# EAGLE design zergpower (EAGLE 4.01)
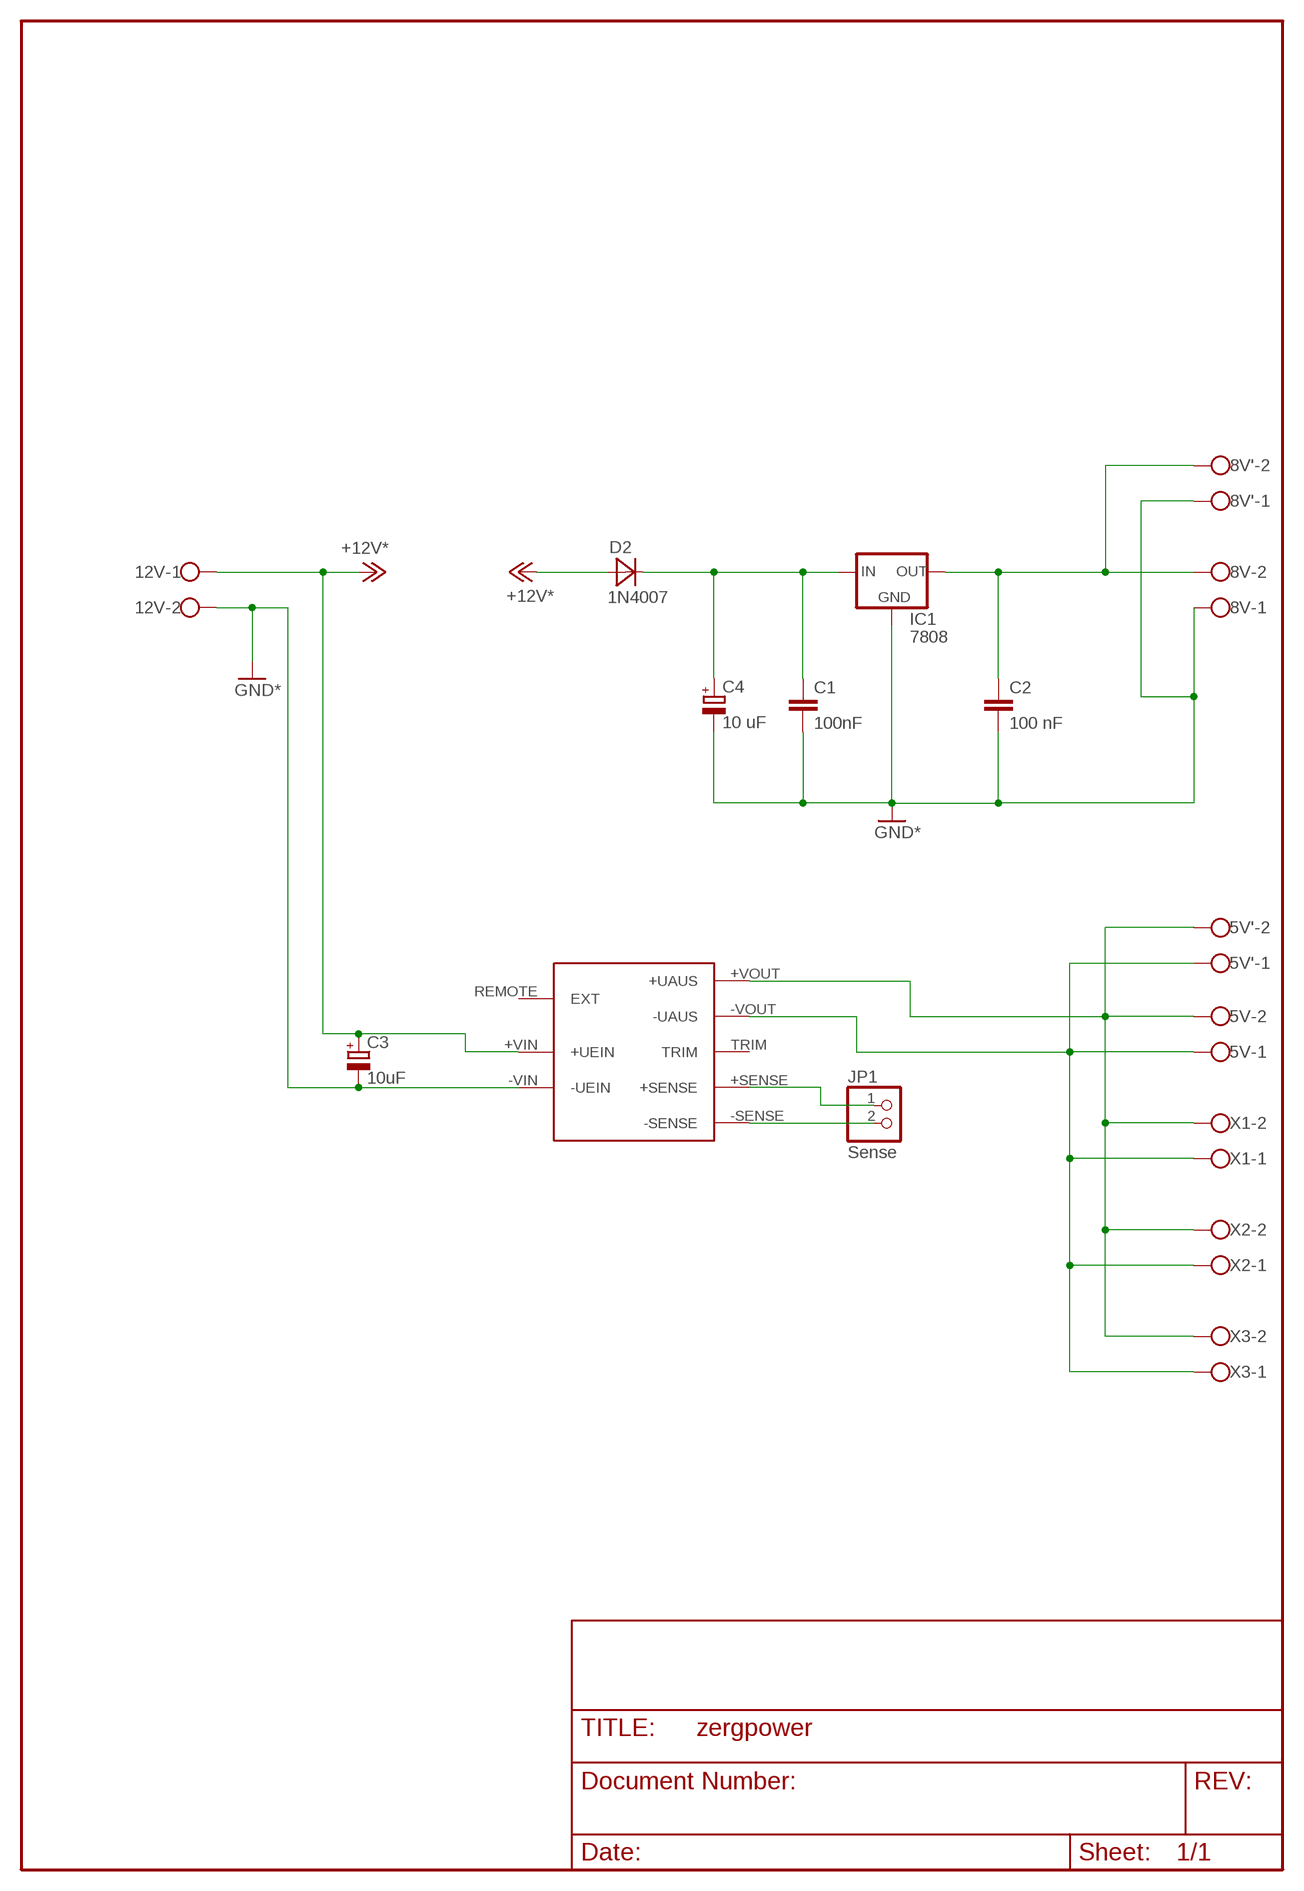
[diagram p0: schematic, sheet 1]

## Parts
5V  AK500/2  [AK500/2]
5V'  AK500/2  [AK500/2]
8V  AK500/2  [AK500/2]
8V'  AK500/2  [AK500/2]
12V  AK500/2  [AK500/2]
C1  100nF  C-EU025-025X050  [C025-025X050]
C2  100 nF  C-EU025-025X050  [C025-025X050]
C3  10uF  CPOL-EUE2.5-7  [E2,5-7]
C4  10 uF  CPOL-EUE2.5-5  [E2,5-5]
D2  1N4007  DIODE-12.5  [D-12.5]
IC1  7808  78XXS  [78XXS]
JP1  Sense  PINHD-1X2  [1X02]
U$1  TEN40N  [TEN40P]
X1  AK500/2  [AK500/2]
X2  AK500/2  [AK500/2]
X3  AK500/2  [AK500/2]

## Nets
+12V: 12V.1 C3.+ D2.A U$1.+VIN(+UEIN) ; supply symbol labelled +12V*
+UAUS: 5V'.2 5V.2 U$1.+VOUT(+UAUS) X1.2 X2.2 X3.2
-UAUS: 5V'.1 5V.1 U$1.-VOUT(-UAUS) X1.1 X2.1 X3.1
GND: 8V'.1 8V.1 12V.2 C1.1 C2.1 C3.- C4.- IC1.GND U$1.-VIN(-UEIN) ; supply symbol labelled GND*
N$1: 8V'.2 8V.2 C2.2 IC1.OUT
N$3: C1.2 C4.+ D2.K(C) IC1.IN
N$9: JP1.1 U$1.+SENSE
N$10: JP1.2 U$1.-SENSE
Unconnected: U$1.REMOTE(EXT) U$1.TRIM

## Library data of the parts
5V 5V' 8V 8V' 12V X1-X3 = con-ptr500:AK500/2: CONNECTOR
C1 C2 = rcl:C-EU: CAPACITOR, European symbol
C3 C4 = rcl:CPOL-EU: POLARIZED CAPACITOR, European symbol
D2 = diode:DIODE-: DIODE
IC1 = v-reg:78XXS: VOLTAGE REGULATOR
JP1 = pinhead:PINHD-1X2: PIN HEADER
U$1 = ten:TEN40

## Board
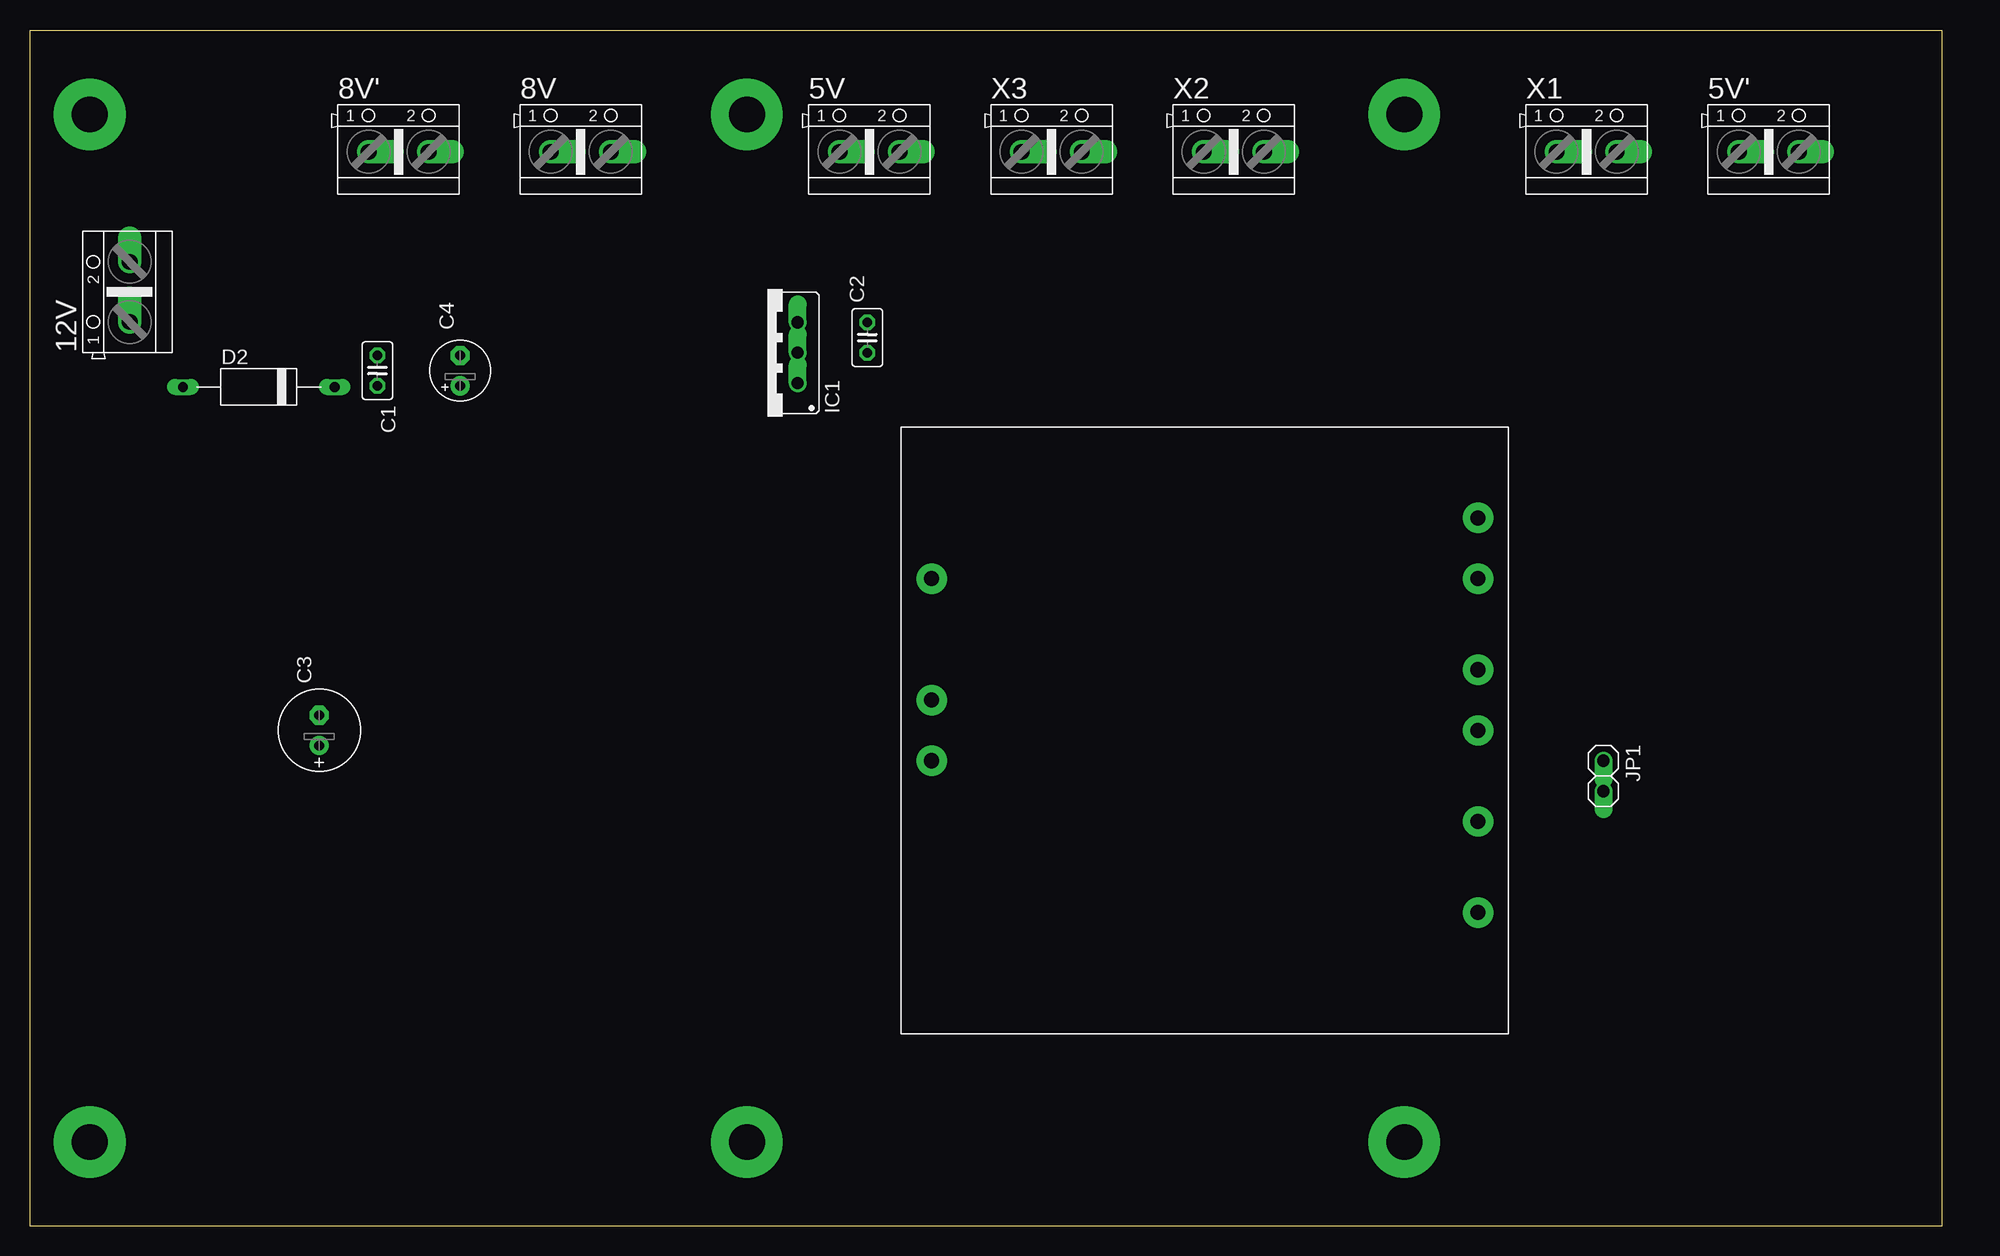
[diagram p1: board, top side]
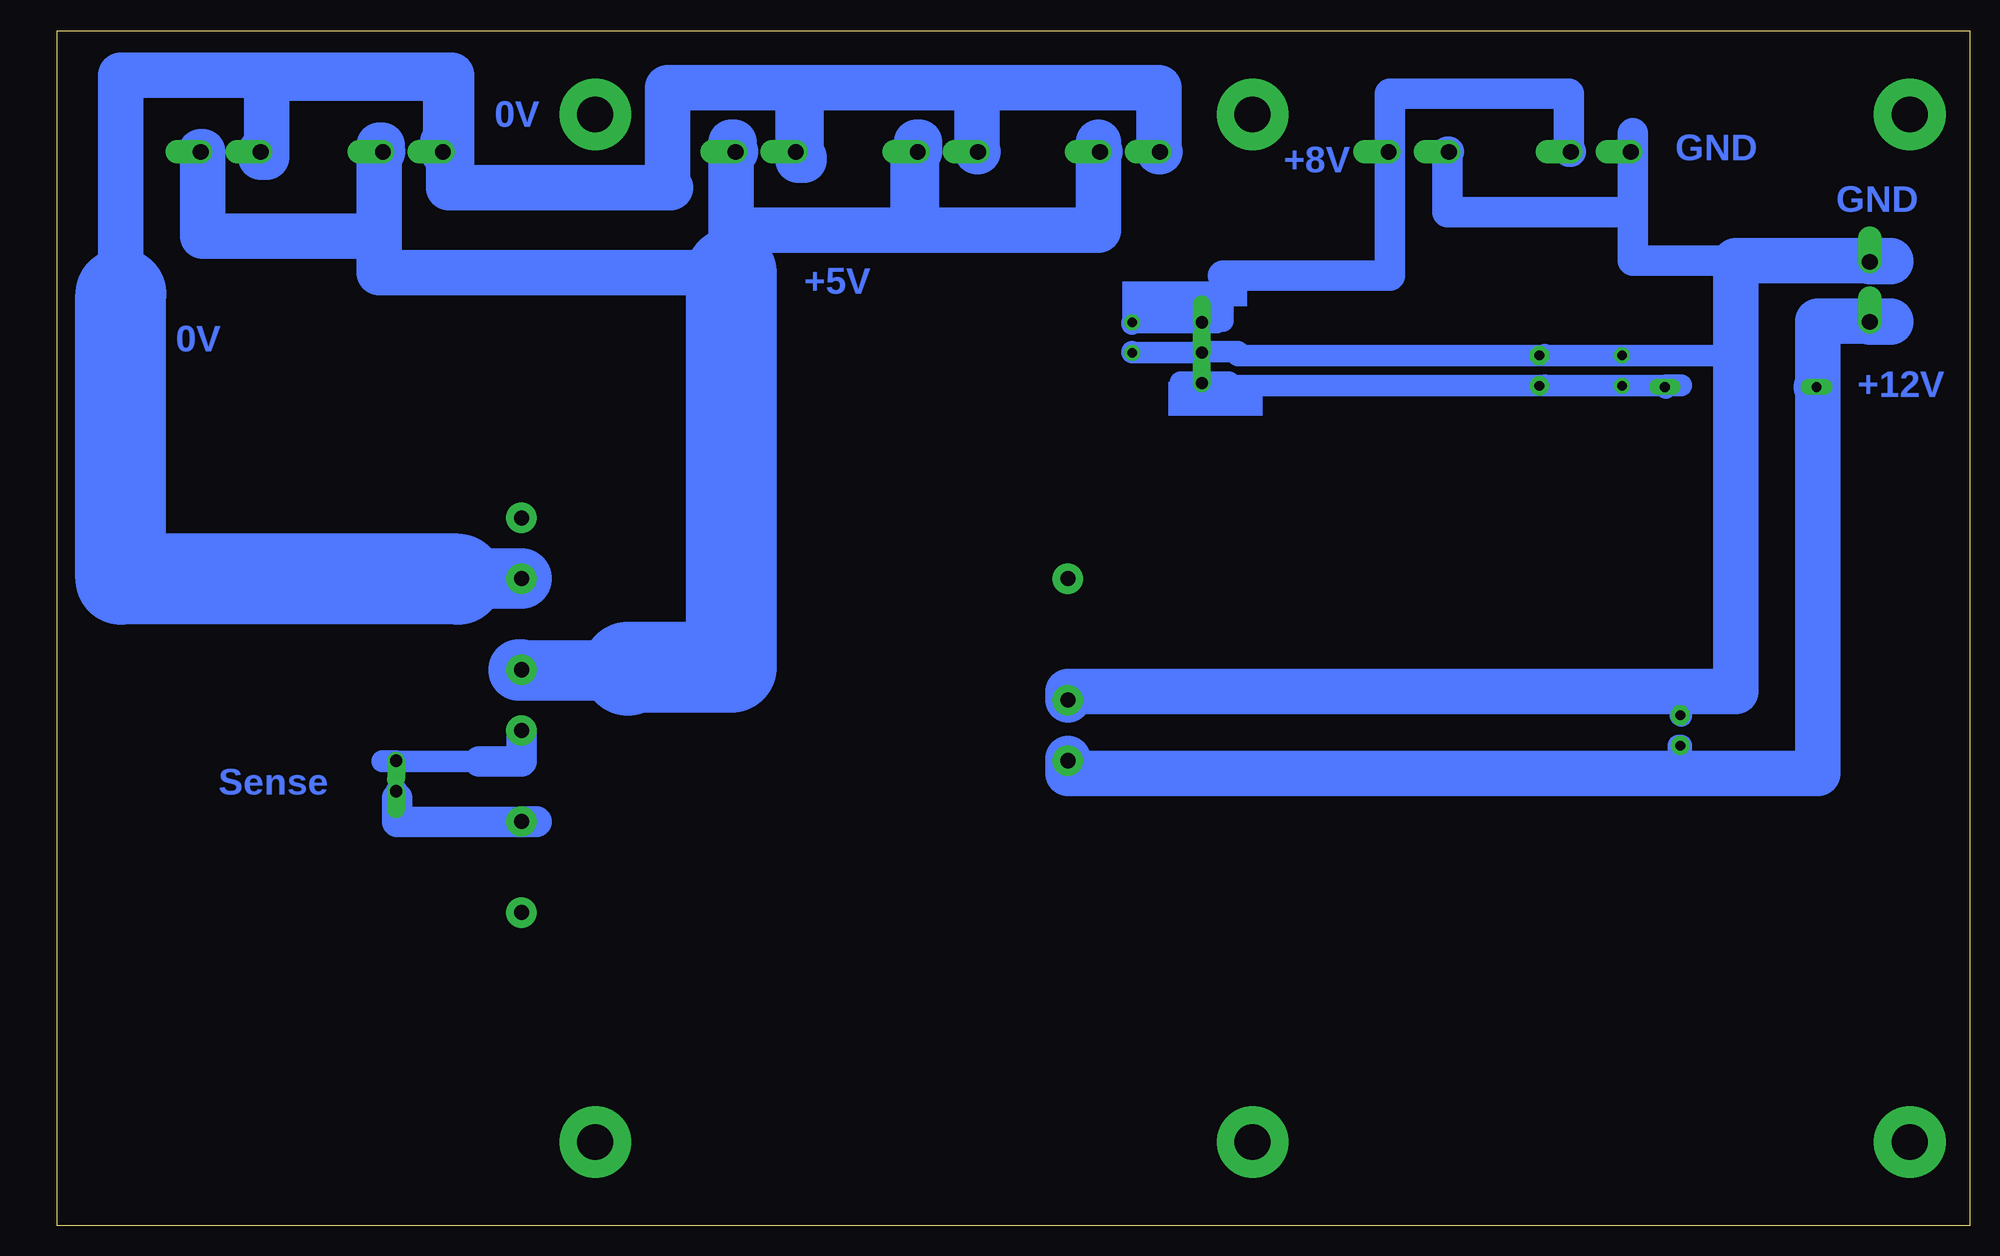
[diagram p2: board, bottom side, seen from below]

Size 160 x 100 mm. Coordinates in mm from the lower left corner, seen from the top.
Outline: 0,0 160,0 160,100 0,100 0,0
Copper layers used: Bottom

### Footprints (pad centres in the part's own frame; a part is rotated, then mirrored left to right if it is on the bottom)
AK500/2 = drill 1.321 offset: 1 -2.515,0; 2 2.515,0
C025-025X050 = drill 0.813 octagon: 1 -1.27,0; 2 1.27,0
E2,5-7 = drill 0.813 pad 1.6 round: + -1.27,0 | drill 0.813 pad 1.6 octagon: - 1.27,0
E2,5-5 = drill 0.813 pad 1.6 round: + -1.27,0 | drill 0.813 pad 1.6 octagon: - 1.27,0
D-12.5 = drill 0.813 long: A -6.35,0; K 6.35,0
78XXS = drill 1.016 offset: GND 0,-2.54; IN -2.54,-2.54; OUT 2.54,-2.54
1X02 = drill 1.016 offset: 1 -1.27,0; 2 1.27,0
TEN40P = drill 1.27 pad 2.54 round: +SENSE 22.86,0; +VIN -22.86,-2.54; +VOUT 22.86,5.08; -SENSE 22.86,-7.62; -VIN -22.86,2.54; -VOUT 22.86,12.7; NOCONN 22.86,-15.24; REMOTE -22.86,12.7; TRIM 22.86,17.78

### Placement (x,y rotation side)
5V  70.25,89.87 0 top
5V'  145.5,89.87 0 top
8V  46.09,89.87 0 top
8V'  30.85,89.87 0 top
12V  8.35,78.15 90 top
C1  29.08,71.56 270 top
C2  70.07,74.33 90 top
C3  24.21,41.45 90 top
C4  36,71.56 90 top
D2  19.16,70.19 0 top
IC1  61.71,73.06 90 top
JP1  131.66,37.64 270 top
U$1  98.31,41.45 0 top
X1  130.26,89.87 0 top
X2  100.73,89.87 0 top
X3  85.49,89.87 0 top

### Tracks (layer width: path | path; a pad name or v marks a point on that pad's centre or on a via)
+12V
  Bottom 1.778: 24.13,37.85 24.13,40.18 C3.+ 24.38,40.18 24.38,37.85
  Bottom 3.81: 12V.1 6.6,75.64 6.6,75.69 12.7,75.69 12.7,70.11 | 12.7,70.19 12.7,70.11 | 12.7,70.11 12.7,69.09 | 12.7,70.19 D2.A | 24.13,37.85 12.7,37.85 12.7,70.19 | 75.44,38.91 75.44,39.12 | 75.44,38.91 U$1.+VIN | 24.38,37.85 75.44,37.85 75.44,38.91
+UAUS
  Bottom 3.81: 72.9,89.87 5V.2 | 72.9,89.87 72.9,90.68 | 72.9,89.87 72.9,83.31 88.14,83.31 88.14,90.68 87.88,90.68 87.88,89.87 X3.2 88.39,89.87 88.39,83.31 103.63,83.31 103.63,90.68 103.38,90.68 103.38,89.87 X2.2 103.63,89.87 103.63,79.76 133.1,79.76 133.1,89.92 | 133.1,89.92 133.1,90.43 132.84,90.43 132.84,89.87 | 132.84,89.87 X1.2 | 5V'.2 147.83,89.87 147.83,82.81 133.1,82.81 133.1,89.92 | 133.1,89.92 133.1,89.87 132.84,89.87
  Bottom 5.08: U$1.+VOUT 121.41,46.53 121.41,46.48 112.27,46.48
  Bottom 7.62: 103.63,79.76 103.63,46.74 112.27,46.74 112.27,46.48
-UAUS
  Bottom 3.81: 5V.1 67.82,89.87 67.82,95.25 83.06,95.25 | X3.1 83.06,89.87 83.06,95.25 | 83.06,95.25 97.79,95.25 97.79,89.41 97.54,89.41 97.54,89.16 98.04,89.16 98.04,89.87 | 98.04,89.87 98.04,89.92 | 98.04,89.87 X2.1 | 98.04,89.87 98.04,95.25 108.97,95.25 108.97,87.12 | 108.97,87.12 108.97,86.87 | 108.97,87.12 109.22,87.12 109.22,86.87 | 109.22,86.87 108.71,86.87 | 109.22,86.87 127.25,86.87 | 127.25,86.87 127.25,90.68 127.76,90.68 127.76,89.87 | 127.76,89.87 X1.1 | 127.76,89.87 127.51,89.87 127.51,96.01 142.49,96.01 142.49,89.41 143,89.41 143,89.87 | 143,89.87 143,89.92 | 143,89.87 5V'.1 | 127.25,86.87 127,86.87 127,96.27 154.69,96.27 154.69,77.98
  Bottom 5.08: U$1.-VOUT 125.98,54.15 125.98,54.1 126.49,54.1
  Bottom 7.62: 126.49,54.1 154.69,54.1 154.69,77.98
GND
  Bottom 1.778: 24.13,42.72 24.13,42.67 | 24.13,42.72 C3.- | 29.46,44.71 24.13,44.71 24.13,42.72 | C4.- C1.1 19.56,72.83 19.56,69.85 | C4.- 35.56,72.83 35.56,72.9 | C4.- 61.21,72.83 61.21,73.15 64.26,73.15 64.26,73.06 IC1.GND 70.1,73.06 | 70.1,73.06 C2.1 | 70.1,73.06 70.1,73.15
  Bottom 2.54: 8V.1 43.69,89.87 43.69,84.84 28.19,84.84 28.19,89.66 | 28.19,89.66 28.19,89.87 | 28.19,89.66 28.19,89.92 | 19.56,80.77 28.19,80.77 28.19,89.66 | 28.19,89.87 28.19,89.92 | 28.19,89.87 8V'.1 | 28.19,89.92 28.19,91.44
  Bottom 3.81: 12V.2 6.6,80.67 6.6,80.77 19.56,80.77 19.56,69.85 19.56,44.71 29.46,44.71 75.44,44.71 75.44,43.99 U$1.-VIN
N$1
  Bottom 1.778: 70.1,75.6 C2.2 | 70.1,75.6 IC1.OUT 62.99,75.6 62.99,75.69 62.48,75.69 62.48,79.5 | 70.1,75.6 70.1,75.44
  Bottom 2.54: 48.51,89.87 48.51,89.92 | 62.48,79.5 48.51,79.5 48.51,89.87 | 48.51,89.87 8V.2 | 48.51,89.87 48.51,94.74 33.53,94.74 33.53,89.87 8V'.2
N$2  (via drill 3 pad 6)
  other vias: 5,7
N$3
  Bottom 1.778: 25.4,70.19 25.4,70.11 | 25.4,70.19 D2.K | 25.4,70.19 25.4,70.36 24.13,70.36 24.13,70.29 C1.2 C4.+ | C4.+ 35.56,70.29 35.56,70.36 | C4.+ 61.98,70.29 61.98,70.61 64.26,70.61 | 64.26,70.61 64.26,70.52 IC1.IN | 64.26,70.61 66.04,70.61
N$4  (via drill 3 pad 6)
  other vias: 5,93
N$7  (via drill 3 pad 6)
  other vias: 60,7
N$8  (via drill 3 pad 6)
  other vias: 115,7
N$9
  Bottom 1.778: JP1.1 132.84,38.91 132.84,38.86 124.71,38.86
  Bottom 2.54: U$1.+SENSE 121.16,41.45 121.16,38.86 124.71,38.86
N$10
  Bottom 1.778: JP1.2 131.57,36.37 131.57,34.8
  Bottom 2.54: U$1.-SENSE 119.89,33.83 119.89,33.78 131.57,33.78 131.57,34.8 131.57,35.82
N$11  (via drill 3 pad 6)
  other vias: 60,93
N$12  (via drill 3 pad 6)
  other vias: 115,93
(copper drawn outside any net)
  shapes: Bottom area x3

### Text on the board
Bottom: 0V | GND | +8V | GND | +5V | 0V | +12V | Sense